# Altium schematic sheet buzzer.SchDoc
size A4; SheetNumber: 11; SheetTotal: 11
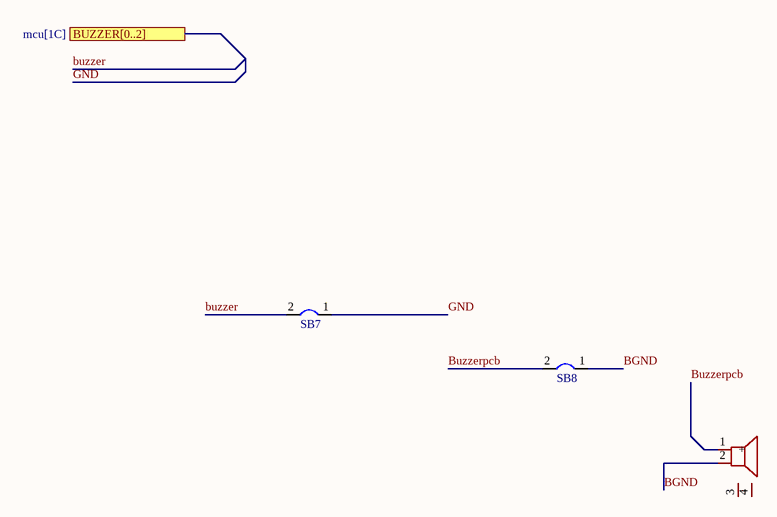
[diagram p0: buzzer.SchDoc]

## Parts
BUZZER1  2.7kHz  [BUZ-SMD_4P-L8.5-W8.5-P8.50-TL]  (value not drawn)
SB7  Jumper  [Jumper]  (value not drawn)
SB8  Jumper  [Jumper]  (value not drawn)

## Ports
BUZZER[0..2] (see mcu[1C])

## Nets
BGND: BUZZER1.2 SB8.1
buzzer: SB7.2
Buzzerpcb: BUZZER1.1(+) SB8.2
GND: SB7.1

Not connected (* = marked no-connect by the designer): BUZZER1 3(NC) 4(NC)

## Library data of the parts
BUZZER1 = MLT-8540: Manufacturer: Jiangsu Huaneng Elec; MFR.Part #: MLT-8540; JLCPCB Part #: C95300